# Altium schematic sheet Inverter_540VDC_V2_TEST.SchDoc
size A0; SheetNumber: 1; SheetTotal: 1; SPICEModelCacheYQEDCYZF: <root> / <DocumentId>YQEDCYZF</DocumentId> / </root>
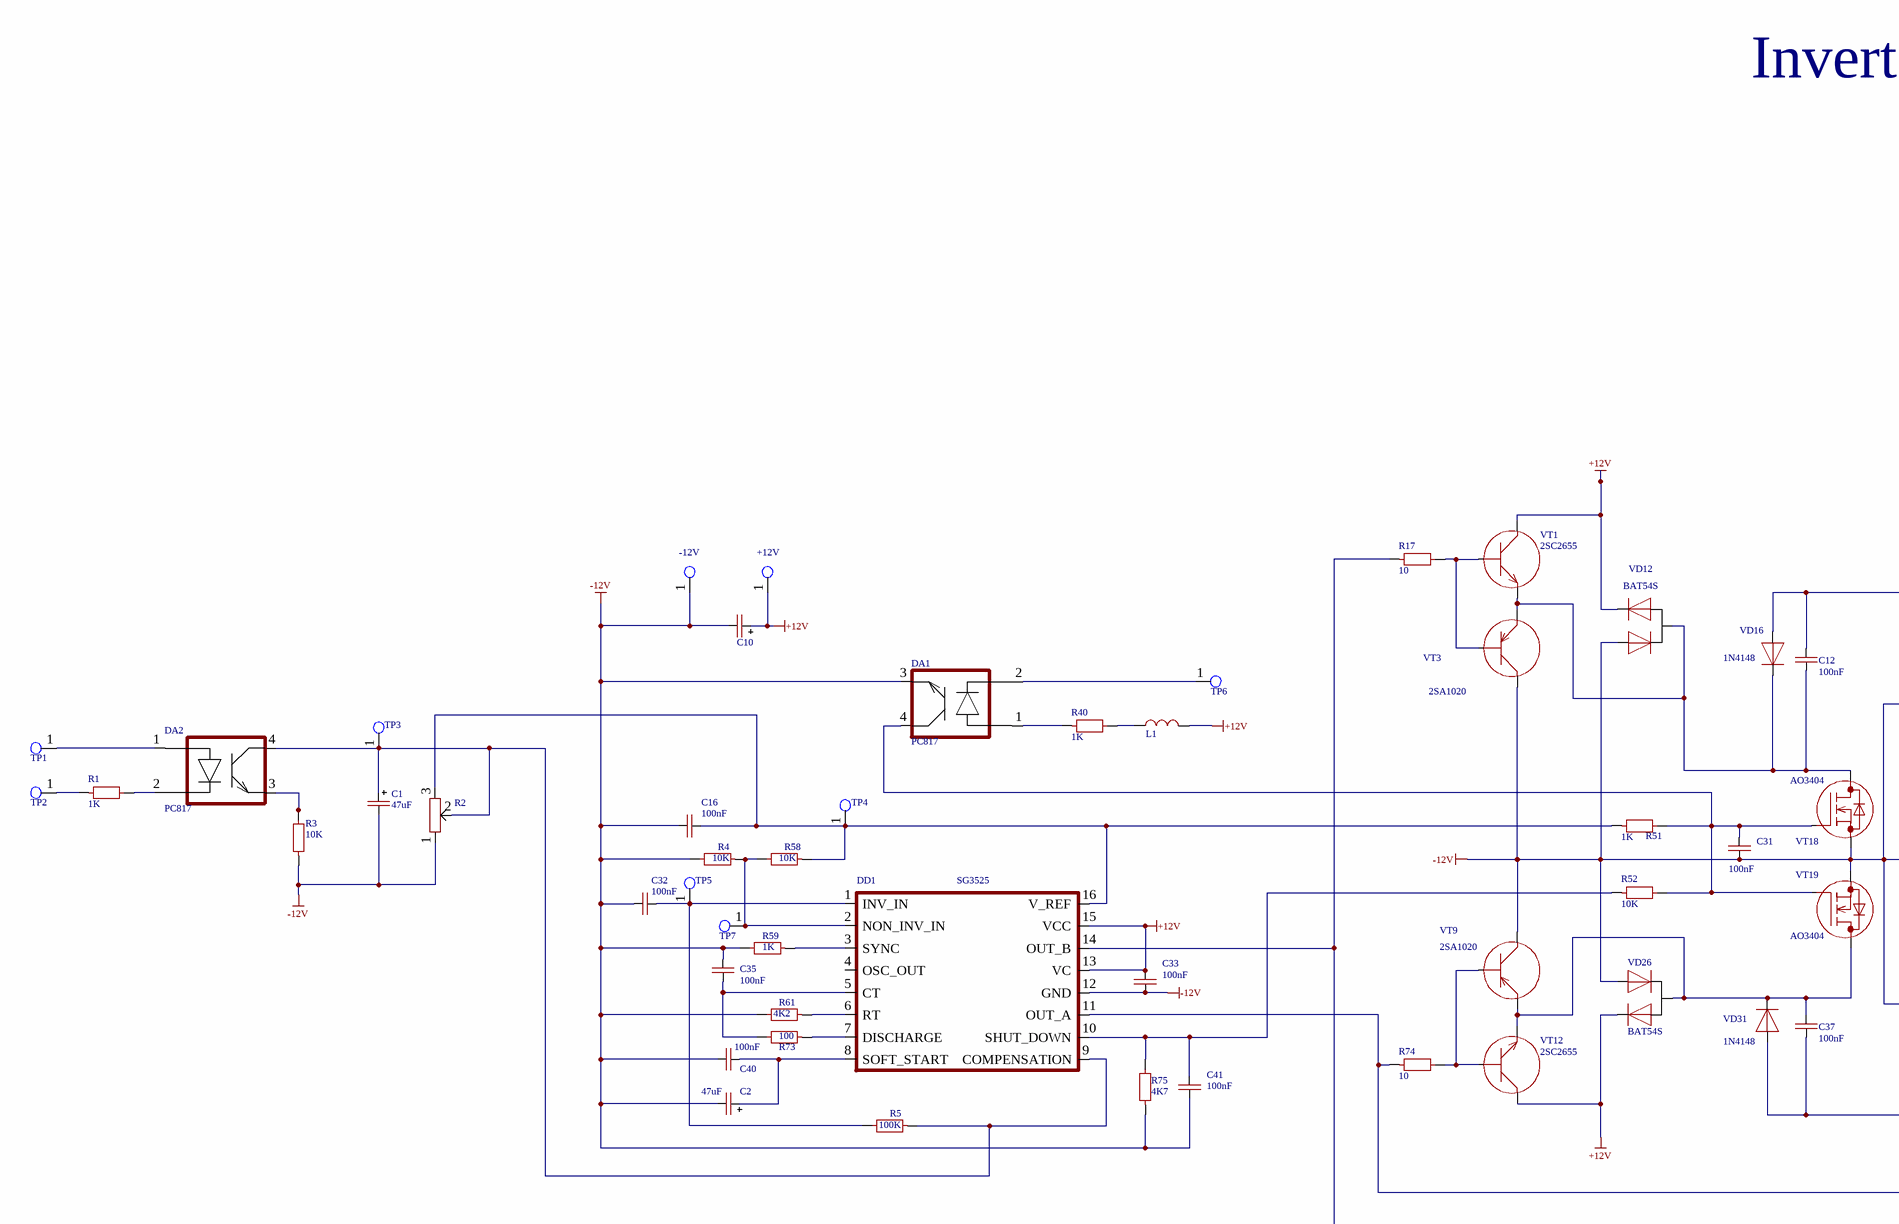
[diagram p0: Inverter_540VDC_V2_TEST.SchDoc, left]
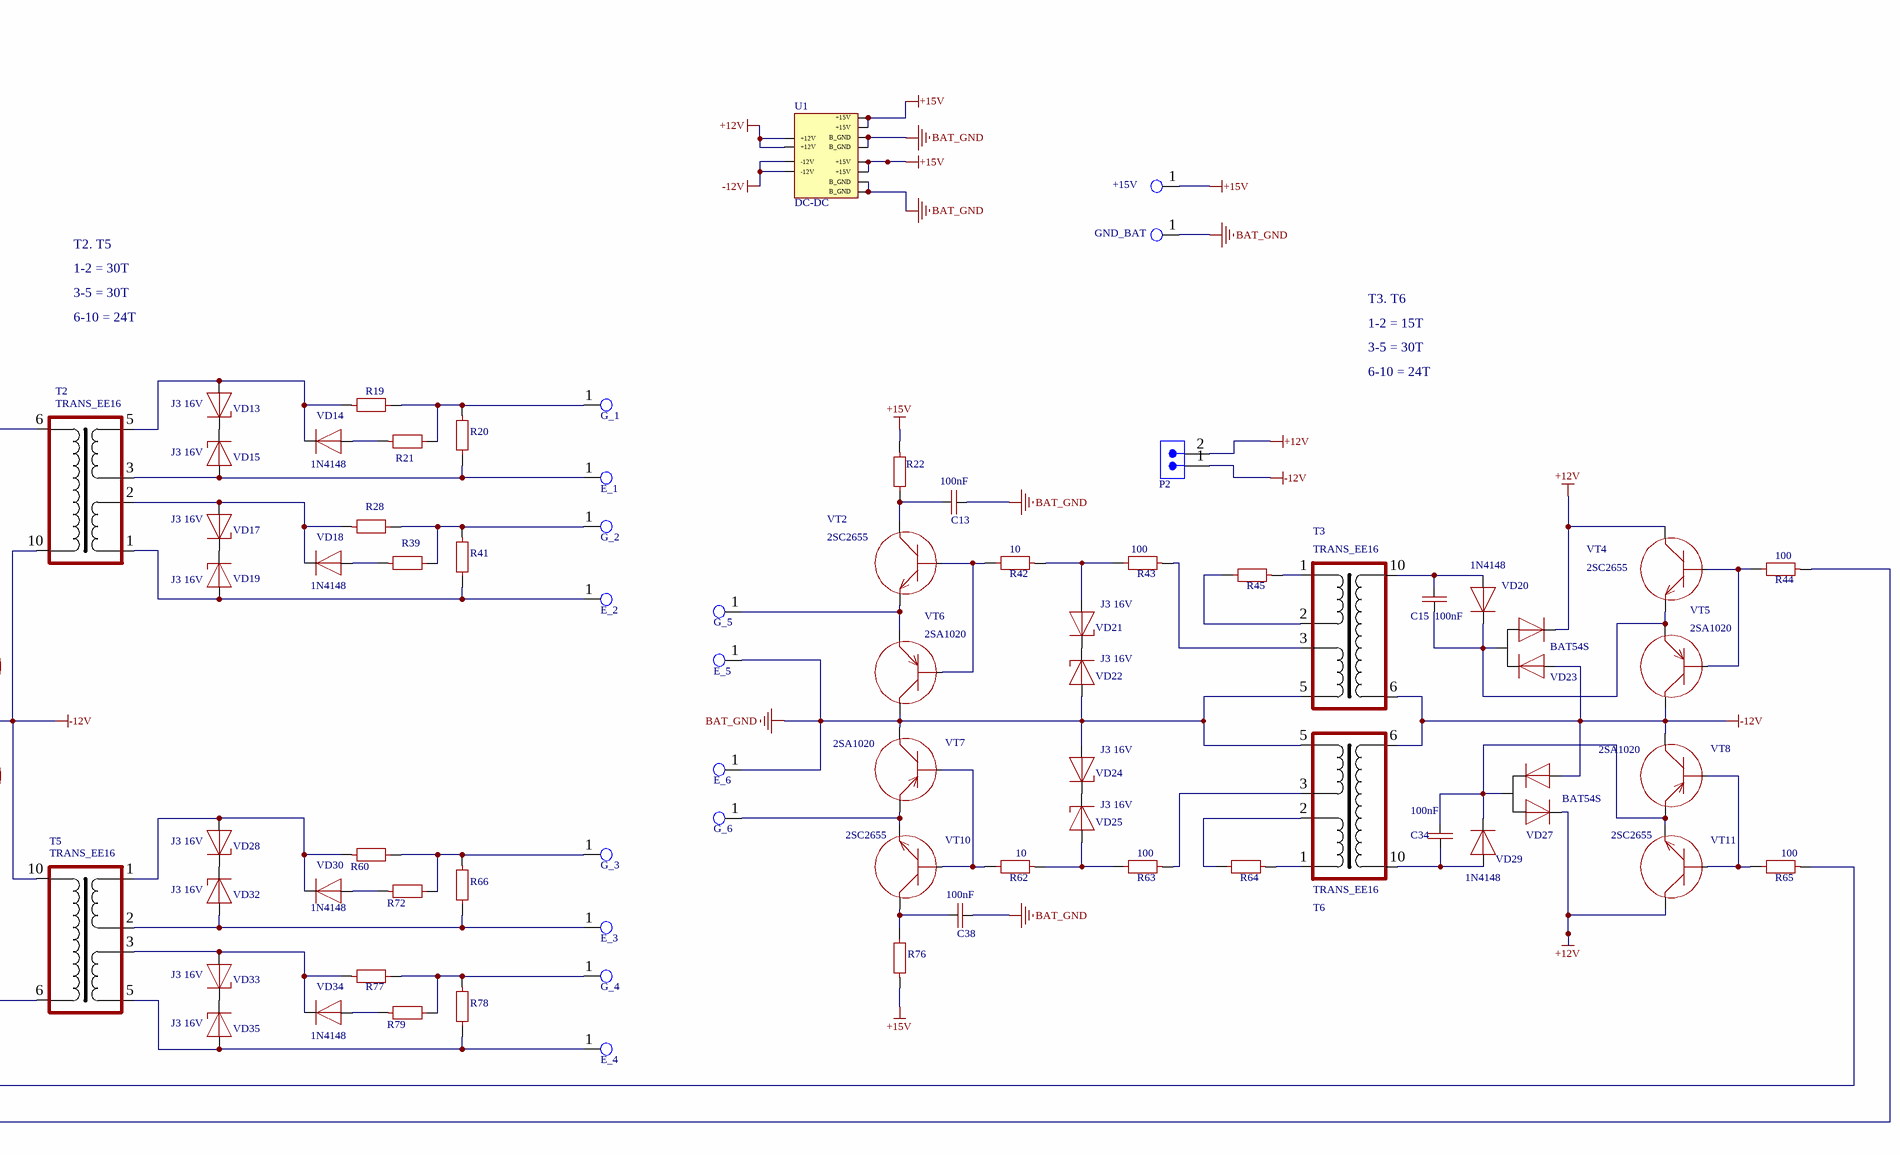
[diagram p1: Inverter_540VDC_V2_TEST.SchDoc, right]

## Parts
+12V  Test_Point_PCB  [Test_Point]  (value not drawn)
+15V  Test_Point_PCB  [Test_Point]  (value not drawn)
-12V  Test_Point_PCB  [Test_Point]  (value not drawn)
C1  47uF  [CAP-TAN-C]
C2  47uF  [CAP-TAN-C]
C10  CAP-POLAR  [CAPPOL_SMD_SIZE_E]  (value not drawn)
C12  100nF  [CAP-1206]
C13  100nF  [CAP-0805]
C15  100nF  [CAP-1206]
C16  100nF  [CAP-0805]
C31  100nF  [CAP-1206]
C32  100nF  [CAP-0805]
C33  100nF  [CAP-0805]
C34  100nF  [CAP-1206]
C35  100nF  [CAP-0805]
C37  100nF  [CAP-1206]
C38  100nF  [CAP-0805]
C40  100nF  [CAP-0805]
C41  100nF  [CAP-0805]
DA1  PC817  [4-SMD]
DA2  PC817  [4-SMD]
DD1  SG3525  [SO16-150]
E_1  Test_Point_PCB  [Test_Point]  (value not drawn)
E_2  Test_Point_PCB  [Test_Point]  (value not drawn)
E_3  Test_Point_PCB  [Test_Point]  (value not drawn)
E_4  Test_Point_PCB  [Test_Point]  (value not drawn)
E_5  Test_Point_PCB  [Test_Point]  (value not drawn)
E_6  Test_Point_PCB  [Test_Point]  (value not drawn)
G_1  Test_Point_PCB  [Test_Point]  (value not drawn)
G_2  Test_Point_PCB  [Test_Point]  (value not drawn)
G_3  Test_Point_PCB  [Test_Point]  (value not drawn)
G_4  Test_Point_PCB  [Test_Point]  (value not drawn)
G_5  Test_Point_PCB  [Test_Point]  (value not drawn)
G_6  Test_Point_PCB  [Test_Point]  (value not drawn)
GND_BAT  Test_Point_PCB  [Test_Point]  (value not drawn)
L1  IND-CONST  [IND-7850]  (value not drawn)
P2  691701530002B  [691701530002B]  (value not drawn)
R1  1K  [RES-0805]
R2  3296W  [3296W]  (value not drawn)
R3  10K  [RES-0805]
R4  10K  [RES-0805]
R5  100K  [RES-0805]
R17  10  [RES-1206]
R19  RES-CONST  [RES-1206]  (value not drawn)
R20  RES-CONST  [RES-1206]  (value not drawn)
R21  RES-CONST  [RES-1206]  (value not drawn)
R22  RES-CONST  [RES-2512]  (value not drawn)
R28  RES-CONST  [RES-1206]  (value not drawn)
R39  RES-CONST  [RES-1206]  (value not drawn)
R40  1K  [RES-0805]
R41  RES-CONST  [RES-1206]  (value not drawn)
R42  10  [RES-1206]
R43  100  [RES-1206]
R44  100  [RES-1206]
R45  RES-CONST  [RES-2512]  (value not drawn)
R51  1K  [RES-1206]
R52  10K  [RES-1206]
R58  10K  [RES-0805]
R59  1K  [RES-0805]
R60  RES-CONST  [RES-1206]  (value not drawn)
R61  4K2  [RES-0805]
R62  10  [RES-1206]
R63  100  [RES-1206]
R64  RES-CONST  [RES-2512]  (value not drawn)
R65  100  [RES-1206]
R66  RES-CONST  [RES-1206]  (value not drawn)
R72  RES-CONST  [RES-1206]  (value not drawn)
R73  100  [RES-0805]
R74  10  [RES-1206]
R75  4K7  [RES-0805]
R76  RES-CONST  [RES-2512]  (value not drawn)
R77  RES-CONST  [RES-1206]  (value not drawn)
R78  RES-CONST  [RES-1206]  (value not drawn)
R79  RES-CONST  [RES-1206]  (value not drawn)
T2  TRANS_EE16  [TRANS_EE16]
T3  TRANS_EE16  [TRANS_EE16]
T5  TRANS_EE16  [TRANS_EE16]
T6  TRANS_EE16  [TRANS_EE16]
TP1  Test_Point_PCB  [Test_Point]  (value not drawn)
TP2  Test_Point_PCB  [Test_Point]  (value not drawn)
TP3  Test_Point_PCB  [Test_Point]  (value not drawn)
TP4  Test_Point_PCB  [Test_Point]  (value not drawn)
TP5  Test_Point_PCB  [Test_Point]  (value not drawn)
TP6  Test_Point_PCB  [Test_Point]  (value not drawn)
TP7  Test_Point_PCB  [Test_Point]  (value not drawn)
U1  DC-DC  [DC-DC_Bridge]
VD12  BAT54S  [SOT23-3]
VD13  J3 16V  [SOD-123]
VD14  1N4148  [SOD-123]
VD15  J3 16V  [SOD-123]
VD16  1N4148  [SOD-123]
VD17  J3 16V  [SOD-123]
VD18  1N4148  [SOD-123]
VD19  J3 16V  [SOD-123]
VD20  1N4148  [SOD-123]
VD21  J3 16V  [SOD-123]
VD22  J3 16V  [SOD-123]
VD23  BAT54S  [SOT23-3]
VD24  J3 16V  [SOD-123]
VD25  J3 16V  [SOD-123]
VD26  BAT54S  [SOT23-3]
VD27  BAT54S  [SOT23-3]
VD28  J3 16V  [SOD-123]
VD29  1N4148  [SOD-123]
VD30  1N4148  [SOD-123]
VD31  1N4148  [SOD-123]
VD32  J3 16V  [SOD-123]
VD33  J3 16V  [SOD-123]
VD34  1N4148  [SOD-123]
VD35  J3 16V  [SOD-123]
VT1  2SC2655  [SOT-89]
VT2  2SC2655  [SOT-89]
VT3  2SA1020  [SOT-89]
VT4  2SC2655  [SOT-89]
VT5  2SA1020  [SOT-89]
VT6  2SA1020  [SOT-89]
VT7  2SA1020  [SOT-89]
VT8  2SA1020  [SOT-89]
VT9  2SA1020  [SOT-89]
VT10  2SC2655  [SOT-89]
VT11  2SC2655  [SOT-89]
VT12  2SC2655  [SOT-89]
VT18  AO3404  [SOT23-3]
VT19  AO3404  [SOT23-3]

## Nets
+12V: +12V.1(G9) C10.1(+) C33.2 DD1.13(VC) DD1.15(VCC) L1.2 P2.2 U1.8(+12V) U1.9(+12V) VD12.2(C) VD23.2(C) VD26.2(C) VD27.2(C) VT1.2(C) VT4.2(C) VT11.2(C) VT12.2(C)
+15V: +15V.1(G9) R22.1 R76.1 U1.1(+15V) U1.2(+15V) U1.17(+15V) U1.18(+15V)
-12V: -12V.1(G9) C1.2(-) C2.2(-) C10.2(-) C16.2 C31.1 C32.2 C33.1 C35.1 C40.2 C41.1 DA1.3(EMITTER) DD1.12(GND) P2.1 R2.1 R3.1 R4.2 R59.2 R61.2 R75.1 T2.10 T3.6 T5.10 T6.6 U1.10(-12V) U1.11(-12V) VD12.1(A) VD23.1(A) VD26.1(A) VD27.1(A) VT3.2(C) VT5.2(C) VT8.2(C) VT9.2(C) VT18.2(S) VT19.2(S)
BAT_GND: C13.1 C38.1 E_5.1(G9) E_6.1(G9) GND_BAT.1(G9) T3.5 T6.5 U1.3(B_GND) U1.4(B_GND) U1.15(B_GND) U1.16(B_GND) VD22.2(A) VD24.2(A) VT6.2(C) VT7.2(C)
NetC1_1: C1.1(+) DA2.4(COLLECTOR) DD1.9(COMPENSATION) R2.2 R5.1 TP3.1(G9)
NetC2_1: C2.1(+) C40.1 DD1.8(SOFT_START)
NetC12_1: C12.1 VD12.3(x) VD16.1(C) VT1.3(E) VT3.3(E) VT18.3(D)
NetC12_2: C12.2 T2.6 VD16.2(A)
NetC13_2: C13.2 R22.2 VT2.2(C)
NetC15_1: C15.1 T3.10 VD20.2(A)
NetC15_2: C15.2 VD20.1(C) VD23.3(x) VT4.3(E) VT5.3(E)
NetC16_1: C16.1 DD1.16(V_REF) R2.3 R51.1 R58.1 TP4.1(G9)
NetC31_2: C31.2 DA1.4(COLLECTOR) R51.2 R52.2 VT18.1(G) VT19.1(G)
NetC32_1: C32.1 DD1.1(INV_IN) R5.2 TP5.1(G9)
NetC34_1: C34.1 VD27.3(x) VD29.1(C) VT8.3(E) VT11.3(E)
NetC34_2: C34.2 T6.10 VD29.2(A)
NetC35_2: C35.2 DD1.5(CT) R73.2
NetC37_1: C37.1 T5.6 VD31.2(A)
NetC37_2: C37.2 VD26.3(x) VD31.1(C) VT9.3(E) VT12.3(E) VT19.3(D)
NetC38_2: C38.2 R76.2 VT10.2(C)
NetC41_2: C41.2 DD1.10(SHUT_DOWN) R52.1 R75.2
NetDA1_1: DA1.1(ANODE) R40.1
NetDA1_2: DA1.2(CATHODE) TP6.1(G9)
NetDA2_1: DA2.1(ANODE) TP1.1(G9)
NetDA2_2: DA2.2(CATHODE) R1.2
NetDA2_3: DA2.3(EMITTER) R3.2
NetDD1_2: DD1.2(NON_INV_IN) R4.1 R58.2 TP7.1(G9)
NetDD1_3: DD1.3(SYNC) R59.1
NetDD1_6: DD1.6(RT) R61.1
NetDD1_7: DD1.7(DISCHARGE) R73.1
NetDD1_11: DD1.11(OUT_A) R65.1 R74.1
NetDD1_14: DD1.14(OUT_B) R17.1 R44.1
NetE_1_1: E_1.1(G9) R20.2 T2.3 VD15.2(A)
NetE_2_1: E_2.1(G9) R41.2 T2.1 VD19.2(A)
NetE_3_1: E_3.1(G9) R66.2 T5.2 VD32.2(A)
NetE_4_1: E_4.1(G9) R78.2 T5.5 VD35.2(A)
NetG_1_1: G_1.1(G9) R19.2 R20.1 R21.2
NetG_2_1: G_2.1(G9) R28.2 R39.2 R41.1
NetG_3_1: G_3.1(G9) R60.2 R66.1 R72.2
NetG_4_1: G_4.1(G9) R77.2 R78.1 R79.2
NetG_5_1: G_5.1(G9) VT2.3(E) VT6.3(E)
NetG_6_1: G_6.1(G9) VT7.3(E) VT10.3(E)
NetL1_1: L1.1 R40.2
NetR1_1: R1.1 TP2.1(G9)
NetR17_2: R17.2 VT1.1(B) VT3.1(B)
NetR19_1: R19.1 T2.5 VD13.2(A) VD14.1(C)
NetR21_1: R21.1 VD14.2(A)
NetR28_1: R28.1 T2.2 VD17.2(A) VD18.1(C)
NetR39_1: R39.1 VD18.2(A)
NetR42_1: R42.1 R43.2 VD21.2(A)
NetR42_2: R42.2 VT2.1(B) VT6.1(B)
NetR43_1: R43.1 T3.3
NetR44_2: R44.2 VT4.1(B) VT5.1(B)
NetR45_1: R45.1 T3.1
NetR45_2: R45.2 T3.2
NetR60_1: R60.1 T5.1 VD28.2(A) VD30.1(C)
NetR62_1: R62.1 R63.2 VD25.2(A)
NetR62_2: R62.2 VT7.1(B) VT10.1(B)
NetR63_1: R63.1 T6.3
NetR64_1: R64.1 T6.1
NetR64_2: R64.2 T6.2
NetR65_2: R65.2 VT8.1(B) VT11.1(B)
NetR72_1: R72.1 VD30.2(A)
NetR74_2: R74.2 VT9.1(B) VT12.1(B)
NetR77_1: R77.1 T5.3 VD33.2(A) VD34.1(C)
NetR79_1: R79.1 VD34.2(A)
NetVD13_1: VD13.1(C) VD15.1(C)
NetVD17_1: VD17.1(C) VD19.1(C)
NetVD21_1: VD21.1(C) VD22.1(C)
NetVD24_1: VD24.1(C) VD25.1(C)
NetVD28_1: VD28.1(C) VD32.1(C)
NetVD33_1: VD33.1(C) VD35.1(C)

Not connected (* = marked no-connect by the designer): DD1 4(OSC_OUT)

## Notes on the sheet
- Inverter_540VDC_V2_TEST
- T2. T5
- 1-2 = 30T
- 3-5 = 30T
- 6-10 = 24T
- T3. T6
- 1-2 = 15T

## Library data of the parts
+12V +15V -12V E_1-E_6 G_1-G_6 GND_BAT TP1-TP7 = TP_PCB?: Test_Point
C1 C2 = CAP-POLAR
C12 C13 C15 C16 C31-C35 C37 C38 C40 C41 = CAP-NON-POLAR
P2 = 691701530002B: WR-TBL Series 7015B Open Horizontal PCB Header, SMT, pitch 5.08mm, 2p; Manufacturer: Wurth Elektronik; Modularity: No; Rated Current: 10A; Working Voltage: 300V; ComponentLink1Description: Website Link; ComponentLink1URL: https://www.we-online.com/redexpert/article/691701530002B?ad; ComponentLink2Description: Datasheet Link; ComponentLink2URL: https://www.we-online.com/redexpert/spec/691701530002B?ad; Manufacturer Part Number: 691701530002B; Category: Terminal Blocks; Match Code: WR-TBL; Mount: Surface Mount; Operating Temperature Max: 105°C; Operating Temperature Min: -40°C; Packaging: Box; Application: Pluggable; Number of Pins: 2; Number of Rows: 1; Orientation: Horizontal; Pitch: 5.08mm
R1 R5 = RES-CONST: 10K
R3 R4 R17 R40 R42-R44 R51 R52 R58 R59 R61-R63 R65 R73-R75 = RES-CONST
U1 = DC-DC/12-18VDC
VD12 VD23 VD26 VD27 = DIODE-4
VD13 VD15 VD17 VD19 VD21 VD22 VD24 VD25 VD28 VD32 VD33 VD35 = ZENER
VD14 VD16 VD18 VD20 VD29-VD31 VD34 = DIODE
VT1 VT2 VT4 VT10-VT12 = BIPOLAR-NPN-BEC
VT3 VT5-VT9 = BIPOLAR-PNP-BCE
VT18 VT19 = MOSFET-N-GDS